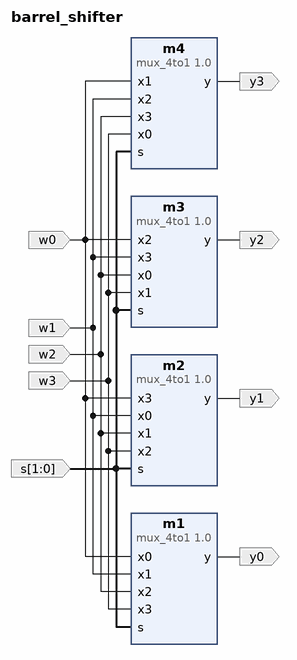
[diagram p0: block diagram of the top level]
# Vivado block design barrel_shifter, xc7a100tcsg324-1, Vivado 2020.2
create_bd_design barrel_shifter

create_bd_port -dir I w0
create_bd_port -dir I w1
create_bd_port -dir I w2
create_bd_port -dir I w3
create_bd_port -dir I -from 1 -to 0 s
create_bd_port -dir O y0
create_bd_port -dir O y1
create_bd_port -dir O y2
create_bd_port -dir O y3

create_bd_cell -type ip -vlnv xilinx.com:user:mux_4to1:1.0 m1
create_bd_cell -type ip -vlnv xilinx.com:user:mux_4to1:1.0 m2
create_bd_cell -type ip -vlnv xilinx.com:user:mux_4to1:1.0 m3
create_bd_cell -type ip -vlnv xilinx.com:user:mux_4to1:1.0 m4

# ---- connections ----

connect_bd_net -net x0_0_1 [get_bd_ports w0] [get_bd_pins m1/x0] [get_bd_pins m2/x3] [get_bd_pins m3/x2] [get_bd_pins m4/x1]
connect_bd_net -net x1_0_1 [get_bd_ports w1] [get_bd_pins m1/x1] [get_bd_pins m2/x0] [get_bd_pins m3/x3] [get_bd_pins m4/x2]
connect_bd_net -net x2_0_1 [get_bd_ports w2] [get_bd_pins m1/x2] [get_bd_pins m2/x1] [get_bd_pins m3/x0] [get_bd_pins m4/x3]
connect_bd_net -net x3_0_1 [get_bd_ports w3] [get_bd_pins m1/x3] [get_bd_pins m2/x2] [get_bd_pins m3/x1] [get_bd_pins m4/x0]
connect_bd_net -net s_0_1 [get_bd_ports s] [get_bd_pins m1/s] [get_bd_pins m2/s] [get_bd_pins m3/s] [get_bd_pins m4/s]
connect_bd_net [get_bd_pins m1/y] [get_bd_ports y0]
connect_bd_net [get_bd_pins m2/y] [get_bd_ports y1]
connect_bd_net [get_bd_pins m3/y] [get_bd_ports y2]
connect_bd_net [get_bd_pins m4/y] [get_bd_ports y3]

validate_bd_design
save_bd_design
